# EAGLE design relaissteuerung (EAGLE 7.3.0)
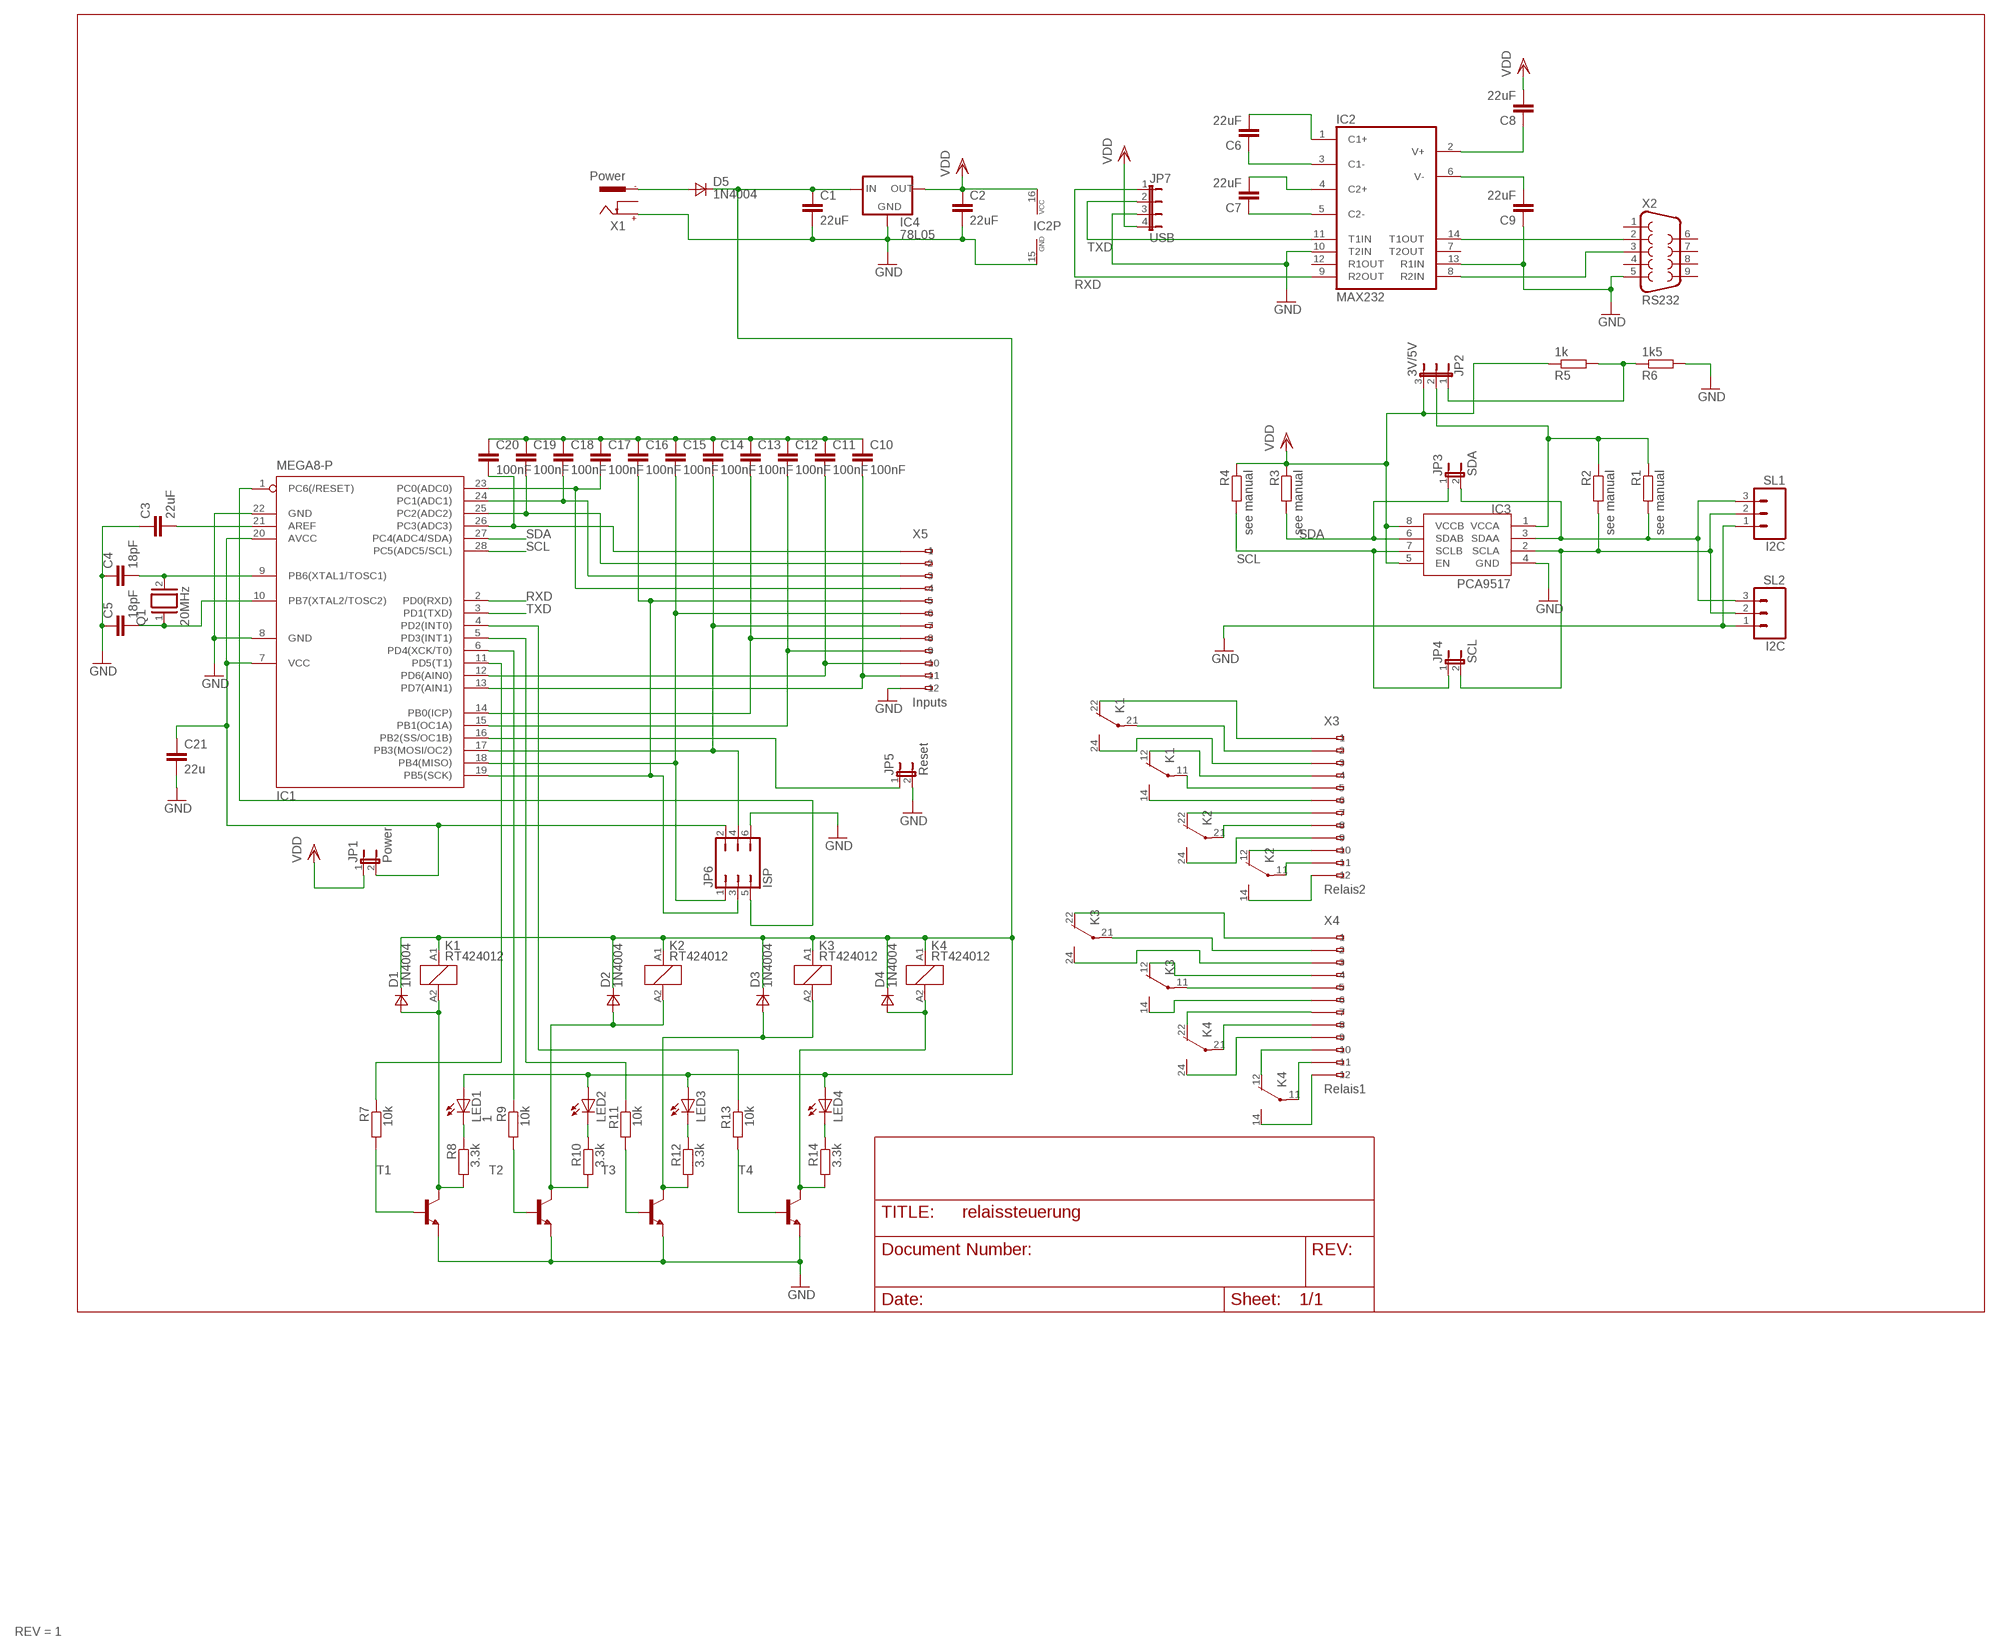
[diagram p0: schematic, sheet 1]
FRAME1 (DINA3_L): REV: 1

## Parts
C1  22uF  C-EUC1206  [C1206]
C2  22uF  C-EUC1206  [C1206]
C3  22uF  C-EUC1206  [C1206]
C4  18pF  C-EU050-025X075  [C050-025X075]
C5  18pF  C-EU050-025X075  [C050-025X075]
C6  22uF  C-EUC1206  [C1206]
C7  22uF  C-EUC1206  [C1206]
C8  22uF  C-EUC1206  [C1206]
C9  22uF  C-EUC1206  [C1206]
C10  100nF  C-EUC1206  [C1206]
C11  100nF  C-EUC1206  [C1206]
C12  100nF  C-EUC1206  [C1206]
C13  100nF  C-EUC1206  [C1206]
C14  100nF  C-EUC1206  [C1206]
C15  100nF  C-EUC1206  [C1206]
C16  100nF  C-EUC1206  [C1206]
C17  100nF  C-EUC1206  [C1206]
C18  100nF  C-EUC1206  [C1206]
C19  100nF  C-EUC1206  [C1206]
C20  100nF  C-EUC1206  [C1206]
C21  22u  C-EUC1206  [C1206]
D1  1N4004  D_E2L  [E2LINE]
D2  1N4004  D_E2L  [E2LINE]
D3  1N4004  D_E2L  [E2LINE]
D4  1N4004  D_E2L  [E2LINE]
D5  1N4004  D_E2L  [E2LINE]
IC1  MEGA8-P  [DIL28-3]
IC2  MAX232  [DIL16]
IC3  PCA9517  [SO-08]
IC4  78L05  78LXX  [78LXX]
JP1  Power  JP1E  [JP1]
JP2  3V/5V  JP2E  [JP2]
JP3  SDA  JP1E  [JP1]
JP4  SCL  JP1E  [JP1]
JP5  Reset  JP1E  [JP1]
JP6  ISP  JP3Q  [JP3Q]
JP7  USB  JP4E  [JP4]
K1  RT424012  [RT2C/O]
K2  RT424012  [RT2C/O]
K3  RT424012  [RT2C/O]
K4  RT424012  [RT2C/O]
LED1  1  LED3MM  [LED3MM]
LED2  LED3MM  [LED3MM]
LED3  LED3MM  [LED3MM]
LED4  LED3MM  [LED3MM]
Q1  20MHz  XTAL/S  [QS]
R1  see manual  R-EU_R1206  [R1206]
R2  see manual  R-EU_R1206  [R1206]
R3  see manual  R-EU_R1206  [R1206]
R4  see manual  R-EU_R1206  [R1206]
R5  1k  R-EU_R1206  [R1206]
R6  1k5  R-EU_R1206  [R1206]
R7  10k  R-EU_R1206  [R1206]
R8  3.3k  R-EU_R1206  [R1206]
R9  10k  R-EU_M1206  [M1206]
R10  3.3k  R-EU_R1206  [R1206]
R11  10k  R-EU_R1206  [R1206]
R12  3.3k  R-EU_R1206  [R1206]
R13  10k  R-EU_M1206  [M1206]
R14  3.3k  R-EU_R1206  [R1206]
SL1  I2C  M03  [03P]
SL2  I2C  M03  [03P]
T1  BC817-16-NPN-SOT23-BEC  [SOT23-BEC]
T2  BC817-16-NPN-SOT23-BEC  [SOT23-BEC]
T3  BC817-16-NPN-SOT23-BEC  [SOT23-BEC]
T4  BC817-16-NPN-SOT23-BEC  [SOT23-BEC]
X1  Power  737992-55  [737992-5]
X2  RS232  F09H  [F09H]
X3  Relais2  233-512  [233-512]
X4  Relais1  233-512  [233-512]
X5  Inputs  233-512  [233-512]

## Nets
C5: C5.2 IC1.10(PB7(XTAL2/TOSC2)) Q1.1
GND: C1.2 C2.2 C3.1 C4.1 C5.1 C9.1 C21.2 IC1.8(GND) IC1.22(GND) IC2.10(T2IN) IC2.13(R1IN) IC2.15(GND) IC3.4(GND) IC4.GND JP5.2 JP6.6 JP7.3 R6.2 SL1.1 SL2.1 T1.E T2.E T3.E T4.E X1.+ X2.5 X5.A12(-12)
N$2: K4.14(2:S) X4.A12(-12)
N$3: C1.1 D1.1(C) D2.1(C) D3.1(C) D4.1(C) D5.1(C) IC4.IN K1.A1 K2.A1 K3.A1 K4.A1 LED1.A LED2.A LED3.A LED4.A
N$4: C20.2 IC1.26(PC3(ADC3)) X5.A1(-1)
N$5: C10.1 C11.1 C12.1 C13.1 C14.1 C15.1 C16.1 C17.1 C18.1 C19.1 C20.1
N$6: K4.11(2:P) X4.A11(-11)
N$7: IC1.1(PC6(/RESET)) JP6.5
N$8: C17.2 IC1.23(PC0(ADC0)) X5.A4(-4)
N$9: K4.12(2:O) X4.A10(-10)
N$10: K4.24(3:S) X4.A9(-9)
N$11: K4.21(3:P) X4.A8(-8)
N$12: K4.22(3:O) X4.A7(-7)
N$13: R11.2 T3.B
N$15: IC1.11(PD5(T1)) R7.1
N$16: K3.14(2:S) X4.A6(-6)
N$17: K3.11(2:P) X4.A5(-5)
N$18: K3.12(2:O) X4.A4(-4)
N$19: C4.2 IC1.9(PB6(XTAL1/TOSC1)) Q1.2
N$20: C18.2 IC1.24(PC1(ADC1)) X5.A3(-3)
N$21: IC1.16(PB2(SS/OC1B)) JP5.1
N$22: IC1.6(PD4(XCK/T0)) R9.1
N$23: C14.2 IC1.17(PB3(MOSI/OC2)) JP6.4 X5.A7(-7)
N$24: C13.2 IC1.14(PB0(ICP)) X5.A8(-8)
N$25: D5.2(A) X1.-1
N$26: IC1.4(PD2(INT0)) R13.1
N$27: K3.24(3:S) X4.A3(-3)
N$28: K3.21(3:P) X4.A2(-2)
N$29: LED4.K(C) R14.1
N$30: LED3.K(C) R12.1
N$31: C12.2 IC1.15(PB1(OC1A)) X5.A9(-9)
N$32: LED2.K(C) R10.1
N$33: C15.2 IC1.18(PB4(MISO)) JP6.1 X5.A6(-6)
N$34: R9.2 T2.B
N$35: C3.2 IC1.21(AREF)
N$36: R13.2 T4.B
N$37: IC3.2(SCLA) JP4.2 R2.2 SL1.2 SL2.2
N$38: C19.2 IC1.25(PC2(ADC2)) X5.A2(-2)
N$39: K3.22(3:O) X4.A1(-1)
N$40: D2.2(A) K2.A2 R10.2 T2.C
N$41: D3.2(A) K3.A2 R12.2 T3.C
N$42: D4.2(A) K4.A2 R14.2 T4.C
N$43: K2.14(2:S) X3.A12(-12)
N$44: K2.11(2:P) X3.A11(-11)
N$45: K2.12(2:O) X3.A10(-10)
N$46: K2.21(3:P) X3.A8(-8)
N$47: K2.24(3:S) X3.A9(-9)
N$48: K2.22(3:O) X3.A7(-7)
N$49: K1.14(2:S) X3.A6(-6)
N$50: K1.11(2:P) X3.A5(-5)
N$51: K1.12(2:O) X3.A4(-4)
N$52: K1.24(3:S) X3.A3(-3)
N$53: K1.21(3:P) X3.A2(-2)
N$54: K1.22(3:O) X3.A1(-1)
N$55: C11.2 IC1.12(PD6(AIN0)) X5.A10(-10)
N$56: C16.2 IC1.19(PB5(SCK)) JP6.3 X5.A5(-5)
N$57: IC3.3(SDAA) JP3.2 R1.2 SL1.3 SL2.3
N$58: C21.1 IC1.7(VCC) IC1.20(AVCC) JP1.2 JP6.2
N$59: IC3.1(VCCA) JP2.2 R1.1 R2.1
N$60: IC2.14(T1OUT) X2.2
N$62: C10.2 IC1.13(PD7(AIN1)) X5.A11(-11)
N$63: JP2.1 R5.2 R6.1
N$64: IC2.8(R2IN) X2.3
N$65: LED1.K(C) R8.1
N$66: D1.2(A) K1.A2 R8.2 T1.C
N$67: R7.2 T1.B
N$69: IC1.5(PD3(INT1)) R11.1
N$70: C9.2 IC2.6(V-)
N$71: C8.1 IC2.2(V+)
N$72: C7.1 IC2.5(C2-)
N$73: C7.2 IC2.4(C2+)
N$74: C6.1 IC2.3(C1-)
N$75: C6.2 IC2.1(C1+)
RXD: IC1.2(PD0(RXD)) IC2.9(R2OUT) JP7.1
SCL: IC1.28(PC5(ADC5/SCL)) IC3.7(SCLB) JP4.1 R4.2
SDA: IC1.27(PC4(ADC4/SDA)) IC3.6(SDAB) JP3.1 R3.2
TXD: IC1.3(PD1(TXD)) IC2.11(T1IN) JP7.2
VDD: C2.1 C8.2 IC2.16(VCC) IC3.5(EN) IC3.8(VCCB) IC4.OUT JP1.1 JP2.3 JP7.4 R3.1 R4.1 R5.1
Unconnected: IC2.7(T2OUT) IC2.12(R1OUT) X1.-2 X1.K X2.1 X2.4 X2.6 X2.7 X2.8 X2.9 X3.B1(B-1) X3.B2(B-2) X3.B3(B-3) X3.B4(B-4) X3.B5(B-5) X3.B6(B-6) X3.B7(B-7) X3.B8(B-8) X3.B9(B-9) X3.B10(B-10) X3.B11(B-11) X3.B12(B-12) X4.B1(B-1) X4.B2(B-2) X4.B3(B-3) X4.B4(B-4) X4.B5(B-5) X4.B6(B-6) X4.B7(B-7) X4.B8(B-8) X4.B9(B-9) X4.B10(B-10) X4.B11(B-11) X4.B12(B-12) X5.B1(B-1) X5.B2(B-2) X5.B3(B-3) X5.B4(B-4) X5.B5(B-5) X5.B6(B-6) X5.B7(B-7) X5.B8(B-8) X5.B9(B-9) X5.B10(B-10) X5.B11(B-11) X5.B12(B-12)

## Library data of the parts
C1-C5 C10-C21 = resistor:C-EU: CAPACITOR, European symbol
C6-C9 = rcl:C-EU: CAPACITOR, European symbol
D1-D5 = zetex:D_E2L: DIODE; OC_FARNELL: unknown; OC_NEWARK: unknown
IC1 = atmel:MEGA8-P: MICROCONTROLLER 8 Kbytes FLASH, 1 kbytes SRAM, 512 bytes EEPROM, USART, 4-channel 10 bit ADC, 2-channel 8 bit ADC Pin compatible with Atmega48, ATMega88, ATMega168 Source: avr.lbr; OC_FARNELL: unknown; OC_NEWARK: unknown
IC2 = maxim:MAX232: RS232 TRANSCEIVER; MF: MAXIM; MPN: MAX232ACPE+; OC_FARNELL: 9723773; OC_NEWARK: 68K4544
IC3 = PCA9517:PCA9517: PCA9517
IC4 = v-reg:78LXX: VOLTAGE REGULATOR
JP1 JP3-JP5 = jumper:JP1E: JUMPER
JP2 = jumper:JP2E: JUMPER
JP6 = jumper:JP3Q: JUMPER
JP7 = jumper:JP4E: JUMPER
K1-K4 = relay:RT42?*: Power PCB Relay SCHRACK 2 pole 8 A, DC and AC-coil Source: http://www.schrack.com/.. 5842.pdf; MPN: RT424012; OC_FARNELL: 1629053; OC_NEWARK: 03P2426
LED1-LED4 = led:LED: LED OSRAM: - CHIPLED LG R971, LG N971, LY N971, LG Q971, LY Q971, LO R971, LY R971 LH N974, LH R974 LS Q976, LO Q976, LY Q976 LO Q996 - Hyper CHIPLED LW Q18S LB Q993, LB Q99A, LB R99A - SideLED LS A670, LO A670, LY A670, LG A670, LP A670 LB A673, LV A673, LT A673, LW A673 LH A674 LY A675 LS A676, LA A676, LO A676, LY A676, LW A676 LS A679, LY A679, LG A679 - Hyper Micro SIDELED® LS Y876, LA Y876, LO Y876, LY Y876 LT Y87S - SmartLED LW L88C, LW L88S LB L89C, LB L89S, LG L890 LS L89K, LO L89K, LY L89K LS L896, LA L896, LO L896, LY L896 - TOPLED LS T670, LO T670, LY T670, LG T670, LP T670 LSG T670, LSP T670, LSY T670, LOP T670, LYG T670 LG T671, LOG T671, LSG T671 LB T673, LV T673, LT T673, LW T673 LH T674 LS T676, LA T676, LO T676, LY T676, LB T676, LH T676, LSB T676, LW T676 LB T67C, LV T67C, LT T67C, LS T67K, LO T67K, LY T67K, LW E67C LS E67B, LA E67B, LO E67B, LY E67B, LB E67C, LV E67C, LT E67C LW T67C LS T679, LY T679, LG T679 LS T770, LO T770, LY T770, LG T770, LP T770 LB T773, LV T773, LT T773, LW T773 LH T774 LS E675, LA E675, LY E675, LS T675 LS T776, LA T776, LO T776, LY T776, LB T776 LHGB T686 LT T68C, LB T68C - Hyper Mini TOPLED® LB M676 - Mini TOPLED Santana® LG M470 LS M47K, LO M47K, LY M47K Source: http://www.osram.convergy.de LUXEON: - LUMILED® LXK2-PW12-R00, LXK2-PW12-S00, LXK2-PW14-U00, LXK2-PW14-V00 LXK2-PM12-R00, LXK2-PM12-S00, LXK2-PM14-U00 LXK2-PE12-Q00, LXK2-PE12-R00, LXK2-PE12-S00, LXK2-PE14-T00, LXK2-PE14-U00 LXK2-PB12-K00, LXK2-PB12-L00, LXK2-PB12-M00, LXK2-PB14-N00, LXK2-PB14-P00, LXK2-PB14-Q00 LXK2-PR12-L00, LXK2-PR12-M00, LXK2-PR14-Q00, LXK2-PR14-R00 LXK2-PD12-Q00, LXK2-PD12-R00, LXK2-PD12-S00 LXK2-PH12-R00, LXK2-PH12-S00 LXK2-PL12-P00, LXK2-PL12-Q00, LXK2-PL12-R00 Source: www.luxeon.com KINGBRIGHT: KA-3528ASYC Source: www.kingbright.com
Q1 = special:XTAL/S: CRYSTAL
R1-R6 = resistor:R-EU_: RESISTOR, European symbol
R7-R14 = rcl:R-EU_: RESISTOR, European symbol
SL1 SL2 = con-amp-quick:M03: AMP QUICK CONNECTOR; OC_FARNELL: unknown; OC_NEWARK: unknown
T1-T4 = transistor-neu-to92:*-NPN-: NPN Transistror
X1 = con-conrad:737992-55: FEMALE PRINT CONNECTOR DIN 45323 (34V/3A), ROKA, distributor Conrad
X2 = con-subd:F09: SUB-D; OC_FARNELL: unknown; OC_NEWARK: unknown
X3-X5 = con-wago255:233-512: WAGO; MF: Wago Corporation; MPN: 0233-0512; OC_FARNELL: 1777102; OC_NEWARK: 79K2055

## Board
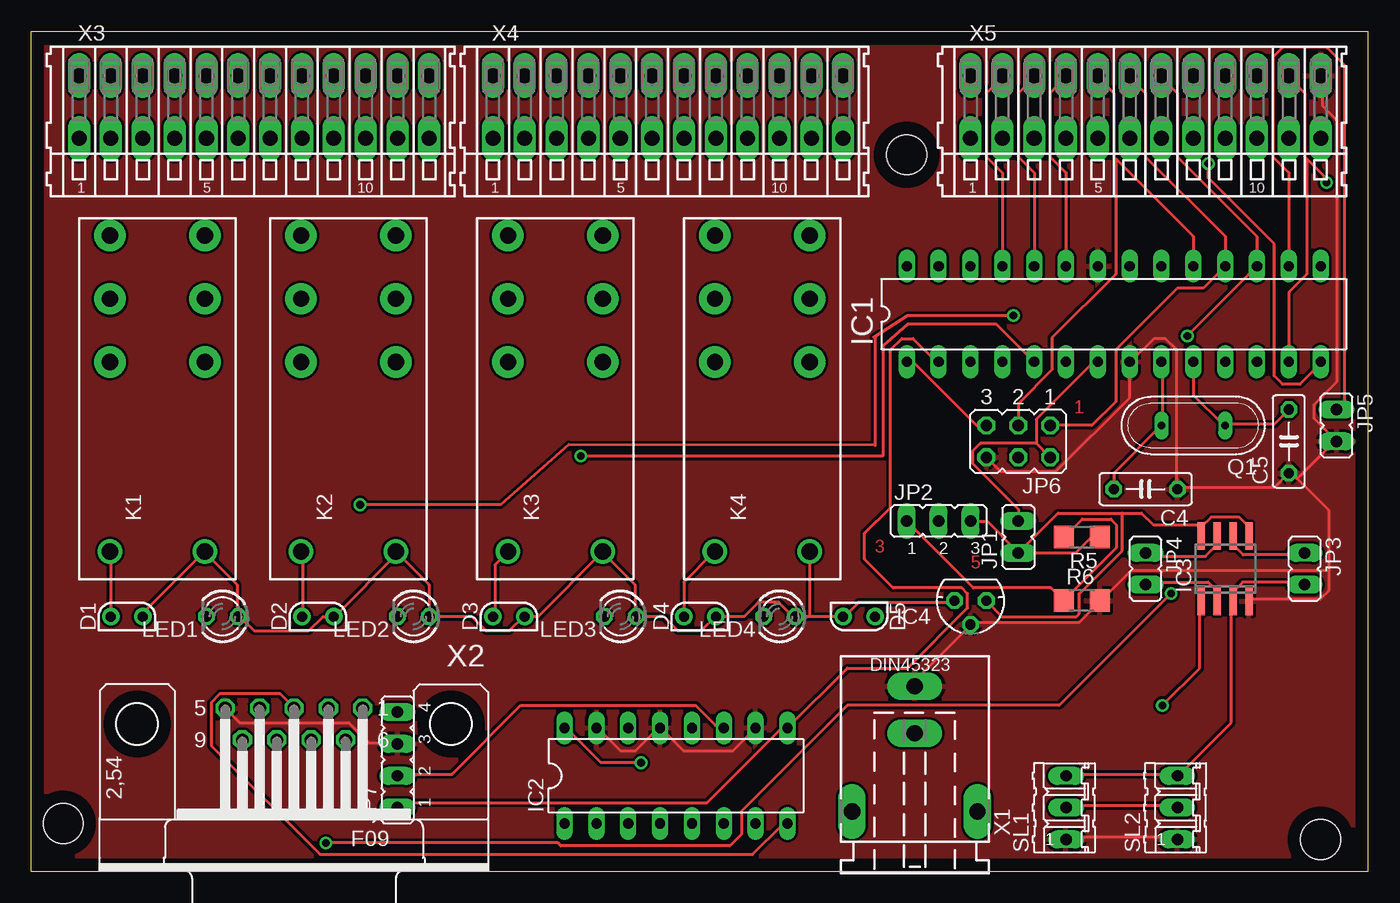
[diagram p1: board, top side]
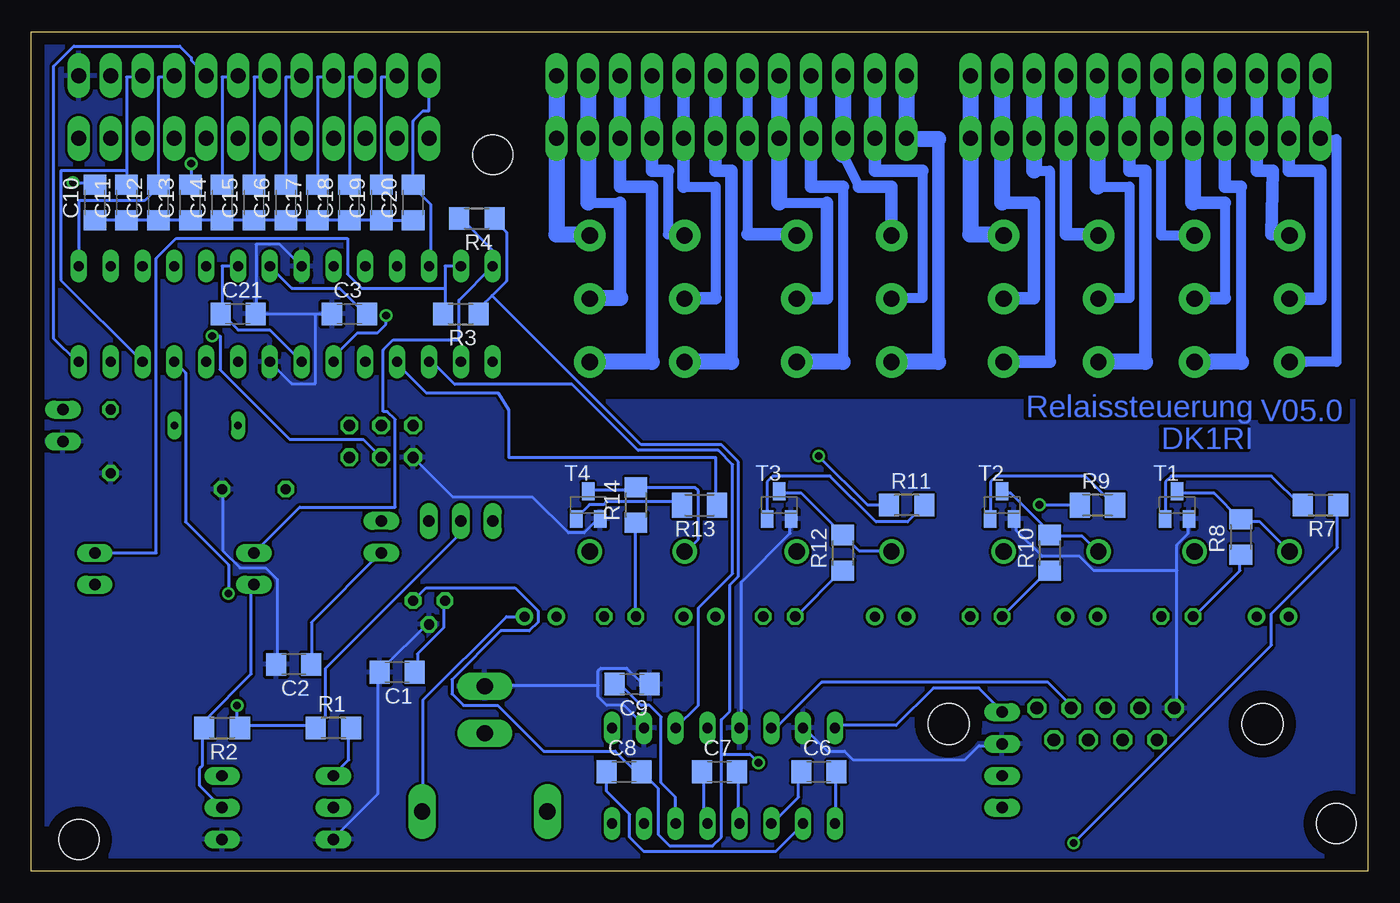
[diagram p2: board, bottom side, seen from below]

Size 106.66 x 66.99 mm. Coordinates in mm from the lower left corner, seen from the top.
Outline: 0,66.98 106.66,66.98 106.66,0 0,0 0,66.99
Copper layers (1*16): Top 0.035mm / dielectric 1.5mm / Bottom 0.035mm
Design rules "default": minimum track width 10mil, minimum drill 24mil, track to track 8mil, track to pad 8mil, pad to pad 8mil, via to via 8mil, smd to smd 8mil, copper to edge 40mil, drill to drill 8mil, minimum pad ring 10mil, minimum via ring 8mil, stop-mask expansion 4mil, vias tented up to drill 0mil, thermal gap 10mil
Holes 3.2 mm at 69.85,57.15 2.54,3.81 102.87,2.54

### Footprints (pad centres in the part's own frame; a part is rotated, then mirrored left to right if it is on the bottom)
C1206 = smd 1.6 x 1.8: 1 -1.4,0; 2 1.4,0
C050-025X075 = drill 0.813 octagon: 1 -2.54,0; 2 2.54,0
E2LINE = drill 0.8 pad 1.397: 1 0,-1.27; 2 0,1.27
DIL28-3 = drill 0.813 long: 1 -16.51,-3.81; 2 -13.97,-3.81; 3 -11.43,-3.81; 4 -8.89,-3.81; 5 -6.35,-3.81; 6 -3.81,-3.81; 7 -1.27,-3.81; 8 1.27,-3.81; 9 3.81,-3.81; 10 6.35,-3.81; 11 8.89,-3.81; 12 11.43,-3.81; 13 13.97,-3.81; 14 16.51,-3.81; 15 16.51,3.81; 16 13.97,3.81; 17 11.43,3.81; 18 8.89,3.81; 19 6.35,3.81; 20 3.81,3.81; 21 1.27,3.81; 22 -1.27,3.81; 23 -3.81,3.81; 24 -6.35,3.81; 25 -8.89,3.81; 26 -11.43,3.81; 27 -13.97,3.81; 28 -16.51,3.81
DIL16 = drill 0.813 long: 1 -8.89,-3.81; 2 -6.35,-3.81; 3 -3.81,-3.81; 4 -1.27,-3.81; 5 1.27,-3.81; 6 3.81,-3.81; 7 6.35,-3.81; 8 8.89,-3.81; 9 8.89,3.81; 10 6.35,3.81; 11 3.81,3.81; 12 1.27,3.81; 13 -1.27,3.81; 14 -3.81,3.81; 15 -6.35,3.81; 16 -8.89,3.81
SO-08 = smd 0.6 x 2.2: 1 -1.905,-2.6; 2 -0.635,-2.6; 3 0.635,-2.6; 4 1.905,-2.6; 5 1.905,2.6; 6 0.635,2.6; 7 -0.635,2.6; 8 -1.905,2.6
78LXX = drill 0.813 octagon: GND 0,1.905; IN 1.27,0; OUT -1.27,0
JP1 = drill 0.914 long: 1 0,-1.27; 2 0,1.27
JP2 = drill 0.914 long: 1 -2.54,0; 2 0,0; 3 2.54,0
JP3Q = drill 0.914 octagon: 1 -2.54,-1.27; 2 -2.54,1.27; 3 0,-1.27; 4 0,1.27; 5 2.54,-1.27; 6 2.54,1.27
JP4 = drill 0.914 long: 1 -3.81,0; 2 -1.27,0; 3 1.27,0; 4 3.81,0
RT2C/O = drill 1.3 pad 2.5: 11 7.56,-3.68; 12 2.52,-3.68; 14 12.6,-3.68; 21 7.56,3.88; 22 2.52,3.88; 24 12.6,3.88 | drill 1.3: A1 -12.6,-3.68; A2 -12.6,3.88
LED3MM = drill 0.813 octagon: A -1.27,0; K 1.27,0
QS = drill 0.61 long: 1 -2.54,0; 2 2.54,0
R1206 = smd 1.6 x 1.803: 1 -1.422,0; 2 1.422,0
M1206 = smd 1.6 x 2: 1 -1.4,0; 2 1.4,0
03P = drill 0.914 long: 1 -2.54,0; 2 0,0; 3 2.54,0
SOT23-BEC = smd 1 x 1.4: B -0.95,-1.1; C 0,1.1; E 0.95,-1.1
737992-5 = drill 1.3 pad 2.184 long: + 0,10; -1 5,0; -2 -5,0; K 0,6.25
F09H = drill 1.016 octagon: 1 -5.486,-1.27; 2 -2.743,-1.27; 3 0,-1.27; 4 2.743,-1.27; 5 5.486,-1.27; 6 -4.115,1.27; 7 -1.372,1.27; 8 1.372,1.27; 9 4.115,1.27 | hole 3.302: -12.522,0; 12.522,0
233-512 = drill 1.2 long: A1 -13.97,2.5; A2 -11.43,2.5; A3 -8.89,2.5; A4 -6.35,2.5; A5 -3.81,2.5; A6 -1.27,2.5; A7 1.27,2.5; A8 3.81,2.5; A9 6.35,2.5; A10 8.89,2.5; A11 11.43,2.5; A12 13.97,2.5; B1 -13.97,-2.5; B2 -11.43,-2.5; B3 -8.89,-2.5; B4 -6.35,-2.5; B5 -3.81,-2.5; B6 -1.27,-2.5; B7 1.27,-2.5; B8 3.81,-2.5; B9 6.35,-2.5; B10 8.89,-2.5; B11 11.43,-2.5; B12 13.97,-2.5

### Placement (x,y rotation side)
C1  77.47,15.88 180 bottom
C2  85.73,16.51 180 bottom
C3  81.28,44.45 0 bottom
C4  88.9,30.48 180 top
C5  100.33,34.29 90 top
C6  43.82,7.94 0 bottom
C7  51.75,7.94 0 bottom
C8  59.37,7.94 0 bottom
C9  58.74,14.92 180 bottom
C10  101.6,53.34 90 bottom
C11  99.06,53.34 90 bottom
C12  96.52,53.34 90 bottom
C13  93.98,53.34 90 bottom
C14  91.44,53.34 90 bottom
C15  88.9,53.34 90 bottom
C16  86.36,53.34 90 bottom
C17  83.82,53.34 90 bottom
C18  81.28,53.34 90 bottom
C19  78.74,53.34 90 bottom
C20  76.2,53.34 90 bottom
C21  90.17,44.45 0 bottom
D1  7.62,20.32 90 top
D2  22.86,20.32 90 top
D3  38.1,20.32 90 top
D4  53.34,20.32 90 top
D5  66.04,20.32 270 top
IC1  86.36,44.45 0 top
IC2  51.44,7.62 0 top
IC3  95.25,24.13 0 top
IC4  74.93,21.59 180 top
JP1  78.74,26.67 0 top
JP2  72.39,27.94 0 top
JP3  101.6,24.13 180 top
JP4  88.9,24.13 180 top
JP5  104.14,35.56 180 top
JP6  78.74,34.29 180 top
JP7  29.21,8.89 90 top
K1  10.16,38.1 90 top
K2  25.4,38.1 90 top
K3  41.91,38.1 90 top
K4  58.42,38.1 90 top
LED1  15.24,20.32 180 top
LED2  30.48,20.32 180 top
LED3  46.99,20.32 180 top
LED4  59.69,20.32 180 top
Q1  92.71,35.56 180 top
R1  82.55,11.43 0 bottom
R2  91.44,11.43 180 bottom
R3  72.39,44.45 180 bottom
R4  71.12,52.07 180 bottom
R5  83.82,26.67 180 top
R6  83.82,21.59 0 top
R7  3.81,29.21 180 bottom
R8  10.16,26.67 90 bottom
R9  21.59,29.21 0 bottom
R10  25.4,25.4 90 bottom
R11  36.83,29.21 0 bottom
R12  41.91,25.4 90 bottom
R13  53.34,29.21 180 bottom
R14  58.42,29.21 90 bottom
SL1  82.55,5.08 90 top
SL2  91.44,5.08 90 top
T1  15.24,29.21 0 bottom
T2  29.21,29.21 0 bottom
T3  46.99,29.21 0 bottom
T4  62.23,29.21 0 bottom
X1  70.48,4.76 0 top
X2  20.95,11.75 180 top
X3  17.78,60.96 0 top
X4  50.8,60.96 0 top
X5  88.9,60.96 0 top

### Tracks (layer width: path | path; a pad name or v marks a point on that pad's centre or on a via)
C5
  Top 0.254: C5.2 100.31,36.78 99.16,35.64 95.28,35.64 Q1.1 95.05,35.64 92.76,37.92 92.76,40.44 IC1.10
GND
  Top 0.254: SL1.1 82.7,2.72 91.39,2.72 SL2.1 | 103.5,23.98 103.5,28.78 100.99,31.29 | 103.5,23.98 103.5,22.38 102.82,21.69 97.33,21.69 IC3.4 | 100.99,31.29 100.53,31.75 C5.1 100.31,31.75 99.16,30.61 91.62,30.61 C4.1 91.39,30.61 91.39,41.58 90.48,42.49 89.56,42.49 87.73,40.66 IC1.8 87.63,37.78 81.76,31.91 77.31,31.91 JP6.6 | 100.99,31.29 103.96,34.27 JP5.2 103.96,34.49 102.36,36.09 102.36,37.24 104.19,39.07 104.19,59.87 103.05,61.01 103.05,63.3 X5.A12 | 103.5,23.98 87.73,23.98 85.45,21.69 R6.2 85.22,21.46 83.62,19.86 74.93,19.86 IC4.GND 74.93,19.63 70.59,15.29 70.59,14.83 X1.+ | JP7.3 29.21,10.26 26.92,10.26 25.32,11.86 16.64,11.86 15.49,13.01 X2.5 | IC2.15 45.21,11.41 47.04,9.58 48.18,9.58 50.01,11.41 IC2.13 50.24,11.41 52.07,9.58 55.96,9.58 57.79,11.41 IC2.10
  Bottom 0.254: 88.74,44.45 83.98,44.45 | 83.98,44.45 C3.1 | 88.74,44.45 88.74,50.01 86.84,50.01 IC1.22 | 88.74,44.45 C21.2 | 83.98,44.45 83.98,38.89 85.88,38.89 IC1.8 | JP6.6 73.03,29.84 66.67,29.84 63.82,26.99 62.55,26.99 61.44,28.1 T4.E | 15.26,23.98 15.26,13.23 X2.5 | 15.26,23.98 15.26,26.04 14.35,26.95 14.35,28.09 T1.E | 15.26,23.98 21.9,23.98 23.04,25.12 26.01,25.12 28.07,27.18 28.07,28.09 T2.E | T3.E 46.13,28.09 46.13,26.95 50.01,23.06 50.01,11.63 IC2.13 | 61.44,14.83 61.44,13.92 60.76,13.23 59.39,13.23 57.79,11.63 IC2.10 | 61.44,14.83 61.44,15.98 61.21,16.2 59.16,16.2 58.01,15.06 57.56,15.06 C9.1 | 61.44,14.83 70.36,14.83 X1.+ | IC4.GND 74.93,19.86 78.82,15.98 C1.2 79.05,15.75 79.05,6.15 82.47,2.72 SL1.1 | C2.2 87.05,16.66 87.05,23.29 87.96,24.21 90.02,24.21 91.39,25.58 91.39,30.38 C4.1 | JP7.3 29.21,10.03 31.04,10.03 32.18,8.89 41.1,8.89 41.78,9.58 43.16,9.58 44.98,11.41 IC2.15
  pour Top: 0.63,66.04 105.73,66.04 105.73,0.64 0.63,0.64
  pour Bottom: 0.95,37.47 66.99,37.47 66.99,38.1 66.99,66.36 105.73,66.36 105.73,0.64 0.95,0.64
N$2
  Bottom 0.406: 62.1,50.8 K4.14
  Bottom 1.27: X4.A12 64.77,50.8 62.1,50.8
N$3
  Top 0.254: 29.21,25.35 31.73,22.84 31.73,20.32 LED2.A 35.15,20.32 36.3,19.18 38.12,19.18 39.27,20.32 D3.1 40.41,20.32 45.44,25.35 K3.A1 45.67,25.35 48.18,22.84 48.18,20.32 LED3.A 50.47,20.32 51.61,19.18 53.44,19.18 54.59,20.32 D4.1 56.87,20.32 58.01,21.46 59.61,21.46 60.76,20.32 LED4.A 62.13,20.32 | 29.21,25.35 24.18,20.32 D2.1 23.27,20.32 22.12,19.18 17.78,19.18 16.64,20.32 LED1.A 16.41,20.32 16.41,22.84 13.89,25.35 K1.A1 13.67,25.35 9.09,20.78 9.09,20.32 D1.1 | 29.21,25.35 K2.A1 | 62.13,20.32 D5.1 64.87,20.32 66.02,21.46 73.56,21.46 IC4.IN | 62.13,20.32 62.13,25.35 K4.A1
  Bottom 0.254: C1.1 75.84,15.98 75.84,17.35 73.79,19.41 73.79,21.46 IC4.IN
N$4
  Bottom 0.254: IC1.26 74.77,48.26 74.77,53.18 76.2,54.61 C20.2 76.2,59.85 75.41,60.64 74.93,60.64 X5.A1
N$5
  Bottom 0.254: 78.74,51.91 76.2,51.91 C20.1 | 78.74,51.91 81.28,51.91 | 78.74,51.91 C19.1 | 81.28,51.91 83.82,51.91 | 81.28,51.91 C18.1 | 83.82,51.91 86.36,51.91 | 83.82,51.91 C17.1 | 86.36,51.91 88.9,51.91 | 86.36,51.91 C16.1 | 88.9,51.91 91.44,51.91 | 88.9,51.91 C15.1 | 91.44,51.91 93.98,51.91 | 91.44,51.91 C14.1 | 93.98,51.91 96.52,51.91 | 93.98,51.91 C13.1 | 96.52,51.91 99.06,51.91 | 96.52,51.91 C12.1 | 99.06,51.91 101.6,51.91 C10.1 | 99.06,51.91 C11.1
N$6
  Bottom 0.406: 62.1,45.72 K4.11
  Bottom 0.813: 62.23,53.34 59.69,53.34
  Bottom 1.016: 59.69,53.34 59.69,45.72
  Bottom 1.27: X4.A11 62.23,53.34 | 59.69,45.72 62.1,45.72
N$7
  Top 0.254: IC1.1 70.33,40.64 75.41,35.56 JP6.5
N$8
  Top 0.254: IC1.23 82.55,55.72 81.28,56.99 81.28,62.07 82.55,63.34 X5.A4
  Bottom 0.254: C17.2 83.82,63.34 82.55,63.34 X5.A4
N$9
  Bottom 0.406: 62.23,40.64 62.1,40.64 K4.12
  Bottom 1.016: X4.A10 59.69,54.61 57.15,54.61 57.15,40.64
  Bottom 1.27: 57.15,40.64 62.1,40.64
N$10
  Bottom 0.406: 54.54,50.8 K4.24
  Bottom 0.813: 55.88,55.88 55.88,50.8 54.54,50.8
  Bottom 1.016: 57.15,57.15 57.15,55.88 55.88,55.88
  Bottom 1.27: X4.A9 57.15,57.15
N$11
  Bottom 0.406: 54.54,45.72 K4.21
  Bottom 0.813: 54.61,54.61 52.07,54.61 52.07,45.72
  Bottom 1.016: X4.A8 54.61,54.61 | 52.07,45.72 54.54,45.72
N$12
  Bottom 0.406: 54.54,40.64 K4.22
  Bottom 1.016: X4.A7 52.07,55.88 50.8,55.88 50.8,40.64
  Bottom 1.27: 50.8,40.64 54.54,40.64
N$13
  Bottom 0.254: T3.B 47.95,28.32 47.95,31.06 47.5,31.52 42.93,31.52 39.27,27.86 36.75,27.86 35.61,29.01 R11.2
N$15  (via drill 0.61)
  Top 0.254: v23.49,2.26 42.01,2.26 42.24,2.03 55.73,2.03 56.64,2.95 56.64,4.78 65.1,13.23 82.02,13.23 v90.93,22.15
  Bottom 0.254: v23.49,2.26 7.72,18.03 7.72,20.55 2.46,25.81 2.46,29.01 R7.1 | v90.93,22.15 90.93,24.44 94.36,27.86 94.36,39.75 IC1.11
N$16
  Bottom 0.406: 45.59,50.8 K3.14
  Bottom 0.813: X4.A6 49.53,50.8
  Bottom 1.016: 49.53,50.8 45.59,50.8
N$17
  Bottom 0.406: 45.59,45.72 K3.11
  Bottom 0.813: 46.99,53.34 43.18,53.34
  Bottom 1.016: 43.18,53.34 43.18,45.72 45.59,45.72
  Bottom 1.27: X4.A5 46.99,53.34
N$18
  Bottom 0.406: 45.59,40.64 K3.12
  Bottom 0.813: 41.91,54.61 41.91,40.64
  Bottom 1.016: X4.A4 44.45,54.61 41.91,54.61
  Bottom 1.27: 41.91,40.64 45.59,40.64
N$19
  Top 0.254: IC1.9 90.25,40.44 90.25,35.64 Q1.2 86.36,31.75 C4.2
N$20
  Top 0.254: IC1.24 80.01,55.72 78.74,56.99 78.74,62.07 80.01,63.34 X5.A3
  Bottom 0.254: C18.2 81.28,63.34 80.01,63.34 X5.A3
N$21
  Top 0.254: IC1.16 100.33,55.72 99.06,56.99 99.06,64.93 99.85,65.72 103.35,65.72 104.78,64.29 104.78,37.47 JP5.1
  Bottom 0.254: JP5.1 102.87,36.83
N$22  (via drill 0.61)
  Top 0.254: v26.24,29.23 37.44,29.23 42.86,34.02 67.31,33.97 67.31,42.54 67.36,42.6 67.22,42.6 69.9,44.32 v78.36,44.32
  Bottom 0.254: v26.24,29.23 23.04,29.23 R9.1 | v78.36,44.32 78.36,43.64 79.05,42.95 80.64,42.95 82.47,41.12 82.47,40.66 IC1.6
N$23  (via drill 0.61)
  Top 0.254: X5.A7 90.17,63.34 91.44,62.07 91.44,56.99 97.79,50.64 IC1.17 v92.23,42.7
  Bottom 0.254: C14.2 91.44,63.34 90.17,63.34 X5.A7 | JP6.4 80.17,34.45 86.04,34.45 91.6,40.01 91.6,42.7 v92.23,42.7
N$24  (via drill 0.61)
  Top 0.254: v93.9,56.44 93.9,55.3 99.16,50.04 99.16,39.52 99.85,38.84 101.22,38.84 102.82,40.44 IC1.14
  Bottom 0.254: v93.9,56.44 93.9,54.84 C13.2 | X5.A8 92.76,63.52 93.9,64.67 93.9,64.9 94.82,65.81 103.28,65.81 104.88,64.21 104.88,42.49 103.05,40.66 IC1.14
N$25
  Bottom 0.254: D5.2 68.76,20.32 75.39,13.69 75.39,4.78 X1.-1
N$26
  Bottom 0.254: R13.1 52.07,29.23 52.07,33.02 68.58,33.02 68.58,36.83 69.42,38.15 75.16,38.15 77.45,40.44 IC1.4
N$27
  Bottom 0.813: 41.91,57.15 40.64,54.61
  Bottom 1.016: 40.64,54.61 38.03,54.61 K3.24
  Bottom 1.27: X4.A3 41.91,57.15
N$28
  Bottom 0.406: 38.03,45.72 K3.21
  Bottom 0.813: 35.56,55.88 35.56,45.72 38.03,45.72
  Bottom 1.016: X4.A2 39.37,55.88 35.56,55.88
N$29
  Bottom 0.254: R14.1 58.47,27.63 58.47,20.32 LED4.K
N$30
  Bottom 0.254: R12.1 42.01,23.98 45.67,20.32 LED3.K
N$31
  Bottom 0.254: X5.A9 95.25,63.34 96.52,63.34 C12.2 96.52,54.61 97.63,53.5 102.87,53.5 IC1.15
N$32
  Bottom 0.254: LED2.K 25.55,23.98 R10.1
N$33
  Top 0.254: X5.A6 87.63,63.34 88.9,62.07 88.9,56.99 95.25,50.64 IC1.18 93.5,46.51 91.44,46.51 86.52,41.59 86.52,37.47 84.61,35.56 JP6.1
  Bottom 0.254: C15.2 88.9,63.34 87.63,63.34 X5.A6
N$34
  Bottom 0.254: T2.B 30.12,28.32 30.12,31.06 29.67,31.52 22.58,31.52 20.3,29.23 R9.2
N$35
  Bottom 0.254: IC1.21 85.88,46.51 82.07,46.51 80.01,44.45 C3.2
N$36
  Bottom 0.254: T4.B 63.04,28.32 62.13,29.23 60.98,29.23 60.76,29.46 55.04,29.46 54.81,29.23 R13.2
N$37
  Top 0.254: IC3.2 94.59,21.69 94.59,22.38 93.9,23.06 89.1,23.06 JP4.2 | SL1.2 82.7,5.23 91.39,5.23 SL2.2
  Bottom 0.254: SL2.2 91.62,5.23 93.22,6.83 93.22,8.2 92.99,8.43 92.99,11.41 R2.2 92.76,11.63 92.76,12.09 89.1,15.75 89.1,22.84 JP4.2
N$38
  Top 0.254: IC1.25 77.47,55.72 76.2,56.99 76.2,62.07 77.47,63.34 X5.A2
  Bottom 0.254: C19.2 78.74,63.34 77.47,63.34 X5.A2
N$39
  Bottom 0.406: 38.03,40.64 K3.22
  Bottom 1.016: 34.29,58.42 34.29,40.64
  Bottom 1.27: X4.A1 36.83,58.42 34.29,58.42 | 34.29,40.64 38.03,40.64
N$40
  Top 0.254: D2.2 21.67,20.32 21.67,25.35 K2.A2
  Bottom 0.254: T2.C 29.21,30.15 28.52,30.15 25.32,26.95 R10.2 25.32,26.72 22.81,26.72 21.67,25.58 K2.A2
N$41
  Top 0.254: 38.12,25.35 K3.A2 37.9,25.35 36.98,24.44 36.98,20.32 D3.2
  Bottom 0.254: T3.C 46.81,30.15 45.21,30.15 42.01,26.95 R12.2 41.78,26.72 40.64,25.58 38.12,25.58 K3.A2
N$42
  Top 0.254: D4.2 52.07,23.06 54.36,25.35 K4.A2
  Bottom 0.254: T4.C 62.13,30.38 58.7,30.38 58.47,30.61 R14.2 58.24,30.61 53.67,30.61 53.44,30.38 53.44,26.49 54.36,25.58 K4.A2
N$43
  Bottom 0.406: 29.08,50.8 K2.14
  Bottom 1.27: X3.A12 31.75,50.8 29.08,50.8
N$44
  Bottom 0.406: 29.08,45.72 K2.11
  Bottom 1.016: 29.21,53.34 26.67,53.34 26.67,45.72 29.08,45.72
  Bottom 1.27: X3.A11 29.21,53.34
N$45
  Bottom 0.406: 29.08,40.64 K2.12
  Bottom 0.813: 26.67,55.88 25.4,55.88 25.4,40.64
  Bottom 1.016: 25.4,40.64 29.08,40.64
  Bottom 1.27: X3.A10 26.67,55.88
N$46
  Bottom 0.406: 21.52,45.72 K2.21
  Bottom 0.813: 21.59,54.61 19.05,54.61 19.05,45.72 21.52,45.72
  Bottom 1.27: X3.A8 21.59,54.61
N$47
  Bottom 0.406: 21.52,50.8 K2.24
  Bottom 1.016: X3.A9 24.13,50.8 21.52,50.8
N$48
  Bottom 0.406: 21.52,40.64 K2.22
  Bottom 1.016: X3.A7 19.05,55.88 17.78,55.88 17.78,40.64
  Bottom 1.27: 17.78,40.64 21.52,40.64
N$49
  Bottom 0.813: K1.14 16.51,50.7 X3.A6
N$50
  Bottom 0.406: 12.57,45.72 K1.11
  Bottom 0.813: 11.43,53.34 11.43,45.72
  Bottom 1.016: 13.97,53.34 11.43,53.34 | 11.43,45.72 12.57,45.72
  Bottom 1.27: X3.A5 13.97,53.34
N$51
  Bottom 0.406: 12.57,40.64 K1.12
  Bottom 0.813: 10.16,54.61 10.16,40.64
  Bottom 1.016: X3.A4 11.43,54.61 10.16,54.61
  Bottom 1.27: 10.16,40.64 12.57,40.64
N$52
  Bottom 1.016: K1.24 7.72,50.8 7.62,55.88 8.89,55.88 X3.A3
N$53
  Bottom 1.016: K1.21 3.81,45.66 3.81,55.88 6.35,55.88 X3.A2
N$54
  Bottom 0.406: X3.A1 3.81,63.5 | 5.01,40.64 K1.22
  Bottom 0.61: 3.81,58.42 2.54,58.42
  Bottom 0.813: 2.54,58.42 2.54,40.64 5.01,40.64
  Bottom 1.27: X3.A1 3.81,58.42
N$55
  Bottom 0.254: 99.06,55.88 99.06,63.34 97.79,63.34 X5.A10 | 99.06,55.88 C11.2 | IC1.12 104.3,47.15 104.3,55.88 99.06,55.88
N$56
  Top 0.254: IC1.19 92.71,50.64 86.6,56.75 | 86.6,56.75 86.36,56.99 86.36,62.07 85.09,63.34 X5.A5 | JP6.3 78.74,37.31 81.44,40.01 81.44,42.54 86.52,47.63 86.52,56.67 86.6,56.75
  Bottom 0.254: C16.2 86.36,63.34 85.25,63.34 X5.A5
  Bottom 0.406: X5.A5 85.09,63.5
N$57
  Top 0.254: JP3.2 101.45,23.06 96.65,23.06 95.96,22.38 95.96,21.69 IC3.3 95.73,21.46 95.73,11.86 91.62,7.75 SL2.3 91.39,7.75 82.7,7.75 SL1.3
  Bottom 0.254: R1.2 81.33,11.41 81.33,8.89 82.47,7.75 SL1.3
N$58
  Top 0.254: JP1.2 78.74,28.89 75.09,32.54 75.09,33.5 75.72,34.13 80.17,34.13 | JP6.2 80.17,34.13 | 80.17,34.13 80.17,36.04 84.77,40.64 IC1.7
  Bottom 0.254: 91.44,44.45 91.44,48.26 IC1.20 | IC1.7 87.63,43.18 90.17,43.18 91.44,44.45 | 91.44,44.45 C21.1
N$59  (via drill 0.61)
  Top 0.254: v90.25,13.23 93.22,16.2 93.22,21.46 IC3.1
  Bottom 0.254: v90.25,13.23 90.25,11.63 R2.1 90.02,11.63 84.07,11.63 R1.1 83.84,11.63 83.16,12.32 83.16,16.2 72.42,26.95 72.42,27.86 JP2.2
N$60
  Bottom 0.254: IC2.14 47.5,11.63 47.04,11.63 43.61,15.06 25.55,15.06 23.72,13.23 X2.2
N$62  (via drill 0.61)
  Top 0.254: v103.35,54.93 103.35,55.24 101.84,56.75 | 101.84,56.75 101.6,56.99 101.6,62.07 100.33,63.34 X5.A11 | IC1.13 100.33,46.2 101.76,47.63 101.76,56.67 101.84,56.75
  Bottom 0.254: v103.35,54.93 101.76,54.93 101.6,54.77 C10.2
N$63
  Top 0.254: 82.55,21.59 R6.1 | R6.1 82.47,21.69 86.59,25.81 86.59,27.63 86.13,28.09 83.84,28.09 82.47,26.72 R5.2 | JP2.1 69.9,27.86 75.16,22.61 81.33,22.61 82.25,21.69 R6.1
N$64
  Top 0.254: IC2.8 60.3,3.63 59.84,3.63 57.56,1.35 23.04,1.35 14.35,10.03 14.35,13.46 15.04,14.15 19.84,14.15 20.75,13.23 X2.3
N$65
  Bottom 0.254: R8.1 10.24,25.12 10.24,23.98 13.89,20.32 LED1.K
N$66
  Top 0.254: D1.2 6.35,25.35 K1.A2
  Bottom 0.254: T1.C 15.04,30.15 12.29,30.15 10.24,28.09 R8.2 10.01,27.86 8.64,27.86 6.35,25.58 K1.A2
N$67
  Bottom 0.254: T1.B 16.18,28.32 16.18,31.06 15.72,31.52 7.72,31.52 5.44,29.23 R7.2
N$69  (via drill 0.61)
  Top 0.254: v43.84,33.12 67.95,33.12 67.95,41.91 69.9,43.64 76.99,43.64 79.96,40.66 IC1.5
  Bottom 0.254: v43.84,33.12 39.95,29.23 38.35,29.23 R11.1
N$70
  Bottom 0.254: C9.2 60.07,14.83 59.61,14.83 58.01,13.23 57.33,13.23 56.41,12.32 56.41,7.06 55.27,5.92 55.27,3.86 IC2.6
N$71
  Bottom 0.254: C8.1 60.76,7.75 60.76,6.38 58.93,4.55 58.93,2.72 57.79,1.58 47.27,1.58 45.21,3.63 IC2.2
N$72
  Bottom 0.254: IC2.5 52.98,4.09 52.98,7.75 C7.1
N$73
  Bottom 0.254: C7.2 50.24,7.75 50.24,3.86 IC2.4
N$74
  Bottom 0.254: C6.1 45.44,7.75 45.44,5.92 47.5,3.86 IC2.3
N$75
  Bottom 0.254: C6.2 42.47,7.75 42.47,3.86 IC2.1
RXD
  Top 0.254: JP7.1 29.21,5.23 29.44,5.46 53.9,5.46 59.84,11.41 60.3,11.41 IC2.9 65.1,16.2 69.9,16.2 74.7,21.01 74.7,22.15 74.24,22.61 68.76,22.61 66.47,24.89 66.47,26.95 68.53,29.01 68.53,41.58 69.44,42.49 70.36,42.49 72.19,40.66 IC1.2
SCL
  Top 0.254: IC3.7 94.59,26.72 94.59,26.04 93.67,25.12 89.33,25.12 89.1,25.35 JP4.1
  Bottom 0.254: R4.2 72.39,52.07 69.85,49.53 IC1.28 72.55,45.56 72.55,42.39 77.79,42.39 78.58,41.59 78.58,36.67 78.26,36.67 77.63,36.04 77.63,29.05 85.25,29.05 JP4.1
SDA
  Top 0.254: IC3.6 95.89,26.04 96.68,25.24 101.44,25.24 JP3.1
  Bottom 0.254: 73.66,46.51 73.66,48.26 IC1.27 | 73.66,46.51 73.66,44.45 R3.2 | 73.66,46.51 80.33,46.51 81.44,47.63 81.44,50.48 95.09,50.48 96.68,48.9 96.68,25.4 JP3.1
TXD
  Top 0.254: IC2.11 55.04,11.63 54.59,11.63 52.98,13.23 39.04,13.23 33.55,7.75 29.21,7.75 JP7.2
  Bottom 0.254: IC2.11 53.44,13.23 53.44,21.01 50.7,23.75 50.7,32.44 51.84,33.58 58.24,33.58 63.5,38.84 72.87,38.84 74.47,40.44 74.93,40.44 IC1.3
VDD  (via drill 0.61)
  Top 0.254: IC3.5 97.16,27.46 96.36,28.26 94.14,28.26 93.34,27.46 IC3.8 93.34,27.62 89.53,27.62 88.58,28.58 87.05,28.58 | 87.05,28.58 81.92,28.58 JP1.1 | R5.1 84.61,26.67 83.34,25.4 JP1.1 | JP2.3 74.93,27.86 76.3,27.86 78.59,25.58 JP1.1 | v48.64,8.66 45.44,8.66 42.7,11.41 IC2.16 | 87.05,28.58 87.05,25.58 83.62,22.15 83.62,20.55 83.39,20.32 77.45,20.32 76.3,21.46 IC4.OUT
  Bottom 0.254: C2.1 84.3,16.66 84.3,19.86 78.82,25.35 JP1.1 | IC2.16 42.47,11.63 37.67,11.63 34.7,14.61 31.04,14.61 29.21,12.78 JP7.4 | 69.9,45.92 68.76,47.07 68.76,50.95 69.67,51.87 R4.1 | 69.9,45.92 70.81,45.01 70.81,44.55 R3.1 | IC4.OUT 76.07,21.69 75.16,22.61 68.07,22.61 66.24,20.78 66.24,19.86 66.93,19.18 69.22,19.18 73.1,15.29 73.1,14.15 72.19,13.23 69.44,13.23 65.79,9.58 60.07,9.58 58.47,7.98 58.01,7.98 C8.2 57.79,7.75 56.64,6.6 56.64,2.95 55.73,2.03 52.3,2.03 51.61,2.72 51.61,9.35 | 69.9,45.92 58.01,34.04 51.61,34.04 50.24,32.66 50.24,23.52 50.93,22.84 50.93,12.78 51.61,12.09 51.61,9.35 | v48.64,8.66 49.33,9.35 51.61,9.35

### Text on the board
Top: 1 | 3 | 5
Bottom: Relaissteuerung | V05.0 | DK1RI